# EAGLE design CS_NAV (EAGLE 9.4.2)
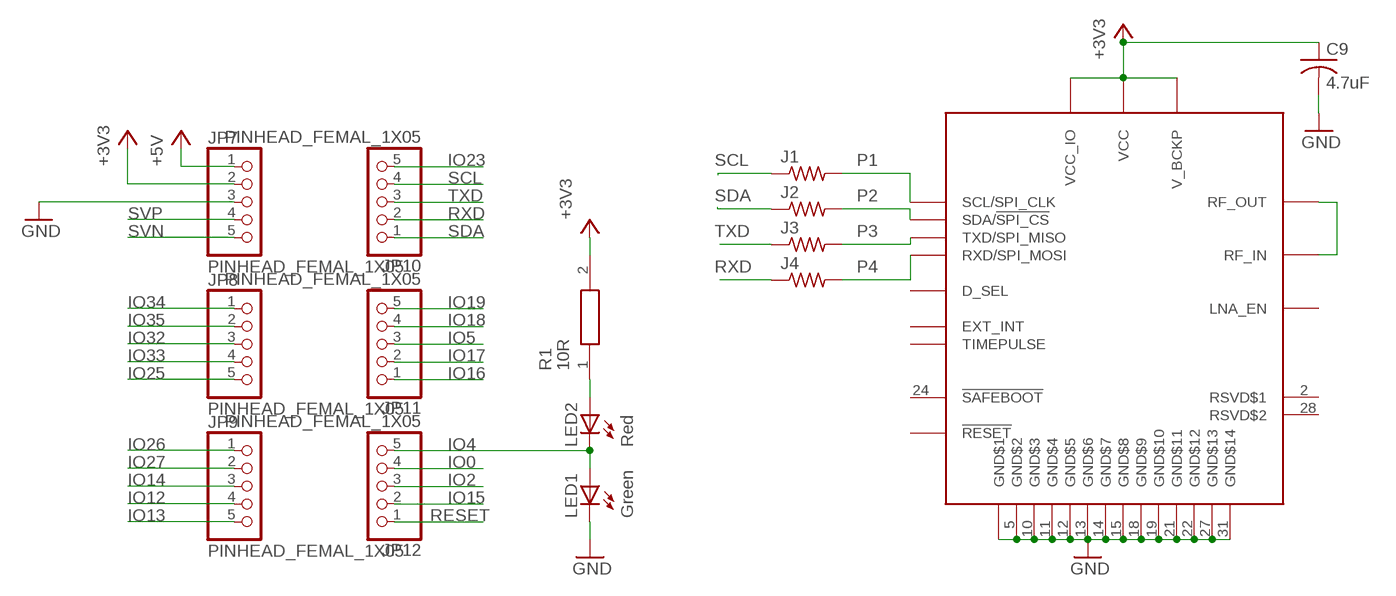
[diagram p0: schematic, sheet 1]

## Parts
C9  4.7uF  C-USC0805  [C0805]
CAM-M8C/Q  CAM-M8  [CAM-M8]
J1  R-US_R1206  [R1206]
J2  R-US_R1206  [R1206]
J3  R-US_R1206  [R1206]
J4  R-US_R1206  [R1206]
JP7  PINHEAD_FEMAL_1X05  [1X05F]
JP8  PINHEAD_FEMAL_1X05  [1X05F]
JP9  PINHEAD_FEMAL_1X05  [1X05F]
JP10  PINHEAD_FEMAL_1X05  [1X05F]
JP11  PINHEAD_FEMAL_1X05  [1X05F]
JP12  PINHEAD_FEMAL_1X05  [1X05F]
LED1  Green  LEDCHIPLED_0805  [CHIPLED_0805]
LED2  Red  LEDCHIPLED_0805  [CHIPLED_0805]
R1  10R  ERA-6AED684V  [RESC2012X60N]

## Nets
+3V3: C9.1 CAM-M8C/Q.1(VCC_IO) CAM-M8C/Q.8(V_BCKP) CAM-M8C/Q.9(VCC) JP7.2 R1.2
+5V: JP7.1
GND: C9.2 CAM-M8C/Q.4(GND$1) CAM-M8C/Q.5(GND$2) CAM-M8C/Q.10(GND$3) CAM-M8C/Q.11(GND$4) CAM-M8C/Q.12(GND$5) CAM-M8C/Q.13(GND$6) CAM-M8C/Q.14(GND$7) CAM-M8C/Q.15(GND$8) CAM-M8C/Q.18(GND$9) CAM-M8C/Q.19(GND$10) CAM-M8C/Q.21(GND$11) CAM-M8C/Q.22(GND$12) CAM-M8C/Q.27(GND$13) CAM-M8C/Q.31(GND$14) JP7.3 LED1.C
IO0: JP12.4
IO2: JP12.3
IO4: JP12.5 LED1.A LED2.C
IO5: JP11.3
IO12: JP9.4
IO13: JP9.5
IO14: JP9.3
IO15: JP12.2
IO16: JP11.1
IO17: JP11.2
IO18: JP11.4
IO19: JP11.5
IO23: JP10.5
IO25: JP8.5
IO26: JP9.1
IO27: JP9.2
IO32: JP8.3
IO33: JP8.4
IO34: JP8.1
IO35: JP8.2
N$1: CAM-M8C/Q.16(RF_OUT) CAM-M8C/Q.17(RF_IN)
N$2: LED2.A R1.1
P1: CAM-M8C/Q.6(SCL/SPI_CLK) J1.2
P2: CAM-M8C/Q.3(SDA/!SPI_CS) J2.2
P3: CAM-M8C/Q.25(TXD/SPI_MISO) J3.2
P4: CAM-M8C/Q.26(RXD/SPI_MOSI) J4.2
RESET: JP12.1
RXD: J4.1 JP10.2
SCL: J1.1 JP10.4
SDA: J2.1 JP10.1
SVN: JP7.5
SVP: JP7.4
TXD: J3.1 JP10.3
Unconnected: CAM-M8C/Q.2(RSVD$1) CAM-M8C/Q.7(EXT_INT) CAM-M8C/Q.20(D_SEL) CAM-M8C/Q.23(!RESET) CAM-M8C/Q.24(!SAFEBOOT) CAM-M8C/Q.28(RSVD$2) CAM-M8C/Q.29(TIMEPULSE) CAM-M8C/Q.30(LNA_EN)

## Library data of the parts
C9 = rcl:C-US: CAPACITOR, American symbol; SPICEPREFIX: C
CAM-M8C/Q = SamacSys_3D:CAM-M8: CAM-M8x: M8 Concurrent GNSS Antenna Module u-blox.com
J1-J4 = rcl:R-US_: RESISTOR, American symbol; SPICEPREFIX: R
JP7-JP12 = SamacSys_3D:PINHEAD_FEMAL_1X05
LED1 LED2 = adafruit:LED: LED OSRAM: - CHIPLED LG R971, LG N971, LY N971, LG Q971, LY Q971, LO R971, LY R971 LH N974, LH R974 LS Q976, LO Q976, LY Q976 LO Q996 - Hyper CHIPLED LW Q18S LB Q993, LB Q99A, LB R99A - SideLED LS A670, LO A670, LY A670, LG A670, LP A670 LB A673, LV A673, LT A673, LW A673 LH A674 LY A675 LS A676, LA A676, LO A676, LY A676, LW A676 LS A679, LY A679, LG A679 - Hyper Micro SIDELED® LS Y876, LA Y876, LO Y876, LY Y876 LT Y87S - SmartLED LW L88C, LW L88S LB L89C, LB L89S, LG L890 LS L89K, LO L89K, LY L89K LS L896, LA L896, LO L896, LY L896 - TOPLED LS T670, LO T670, LY T670, LG T670, LP T670 LSG T670, LSP T670, LSY T670, LOP T670, LYG T670 LG T671, LOG T671, LSG T671 LB T673, LV T673, LT T673, LW T673 LH T674 LS T676, LA T676, LO T676, LY T676, LB T676, LH T676, LSB T676, LW T676 LB T67C, LV T67C, LT T67C, LS T67K, LO T67K, LY T67K, LW E67C LS E67B, LA E67B, LO E67B, LY E67B, LB E67C, LV E67C, LT E67C LW T67C LS T679, LY T679, LG T679 LS T770, LO T770, LY T770, LG T770, LP T770 LB T773, LV T773, LT T773, LW T773 LH T774 LS E675, LA E675, LY E675, LS T675 LS T776, LA T776, LO T776, LY T776, LB T776 LHGB T686 LT T68C, LB T68C - Hyper Mini TOPLED® LB M676 - Mini TOPLED Santana® LG M470 LS M47K, LO M47K, LY M47K Source: http://www.osram.convergy.de/
R1 = SamacSys_Parts:ERA-6AED684V: Thin Film Resistors - SMD 0805 680Kohms 25ppm 0.5% AEC-Q200 Source: Datasheet <https://industrial.panasonic.com/cdbs/www-data/pdf/RDA0000/AOA0000C237.pdf>; DESCRIPTION: Thin Film Resistors - SMD 0805 680Kohms 25ppm 0.5% AEC-Q200; HEIGHT: 0.6mm; MANUFACTURER_NAME: Panasonic; MANUFACTURER_PART_NUMBER: ERA-6AED684V; MOUSER_PART_NUMBER: 667-ERA-6AED684V; MOUSER_PRICE-STOCK: https://www.mouser.com/Search/Refine.aspx?Keyword=667-ERA-6AED684V

## Board
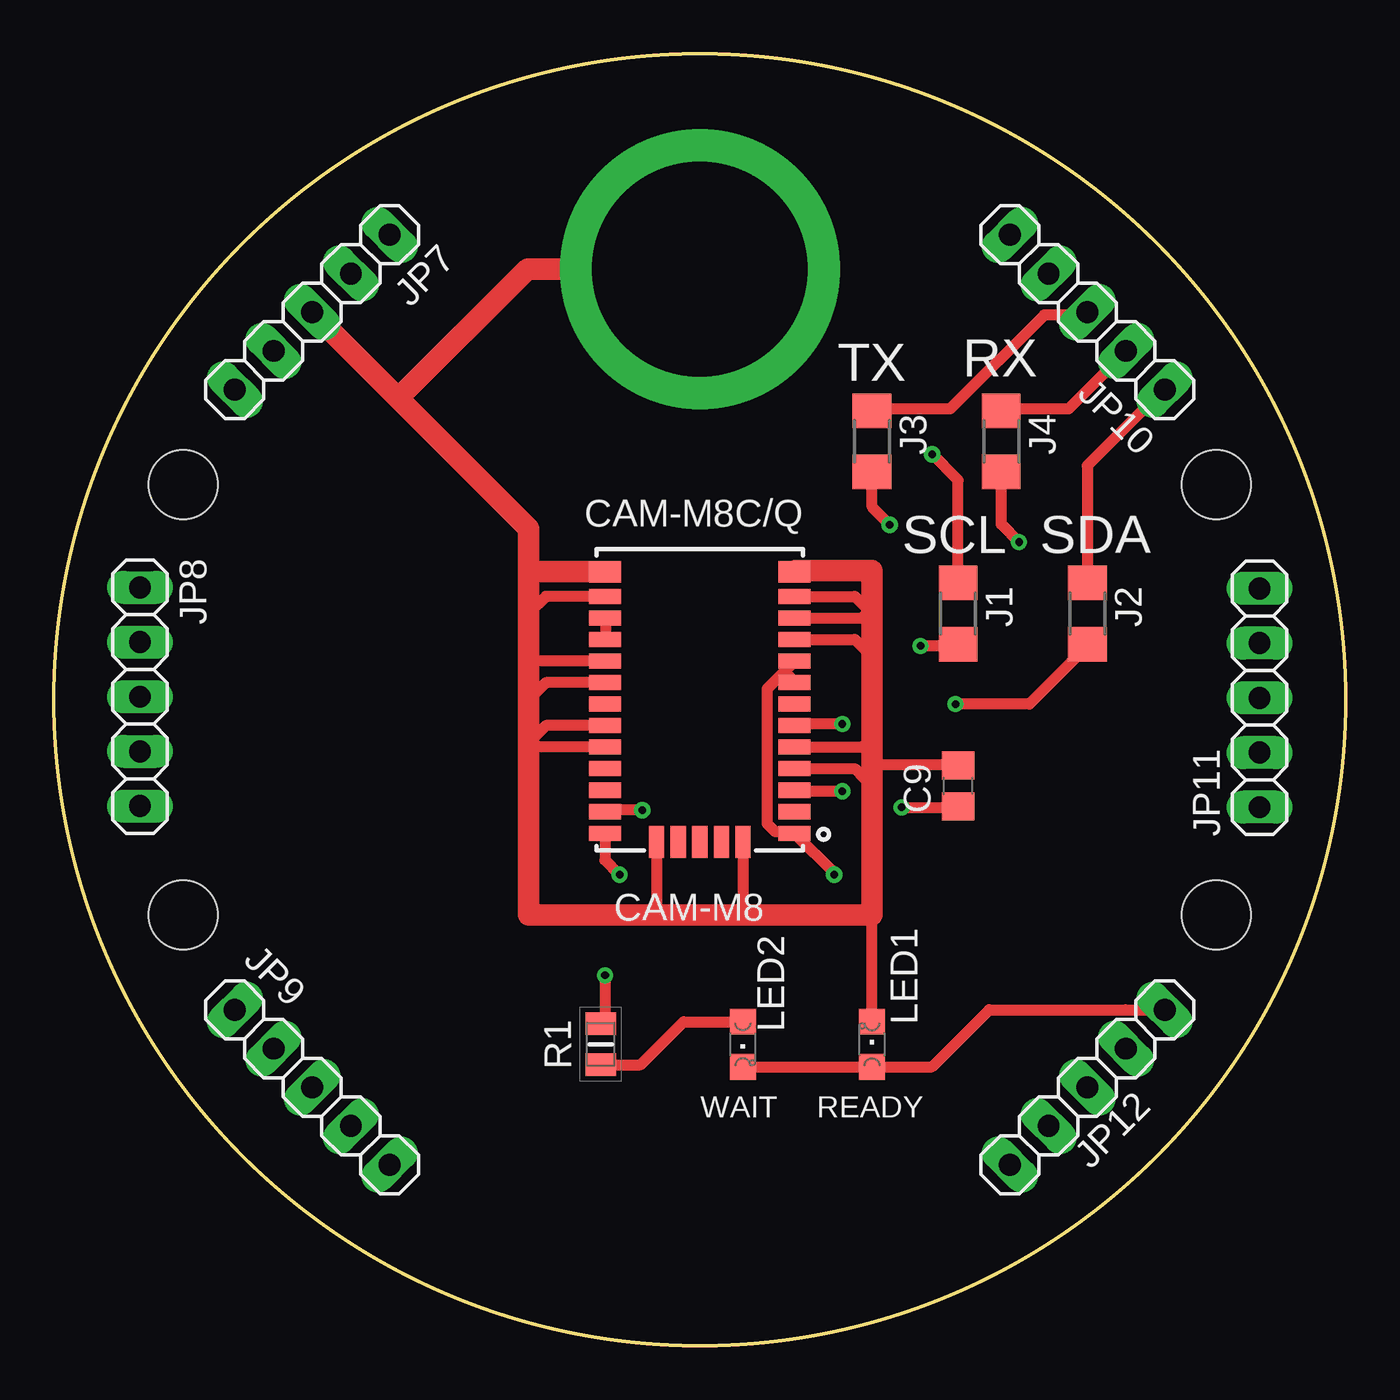
[diagram p1: board, top side]
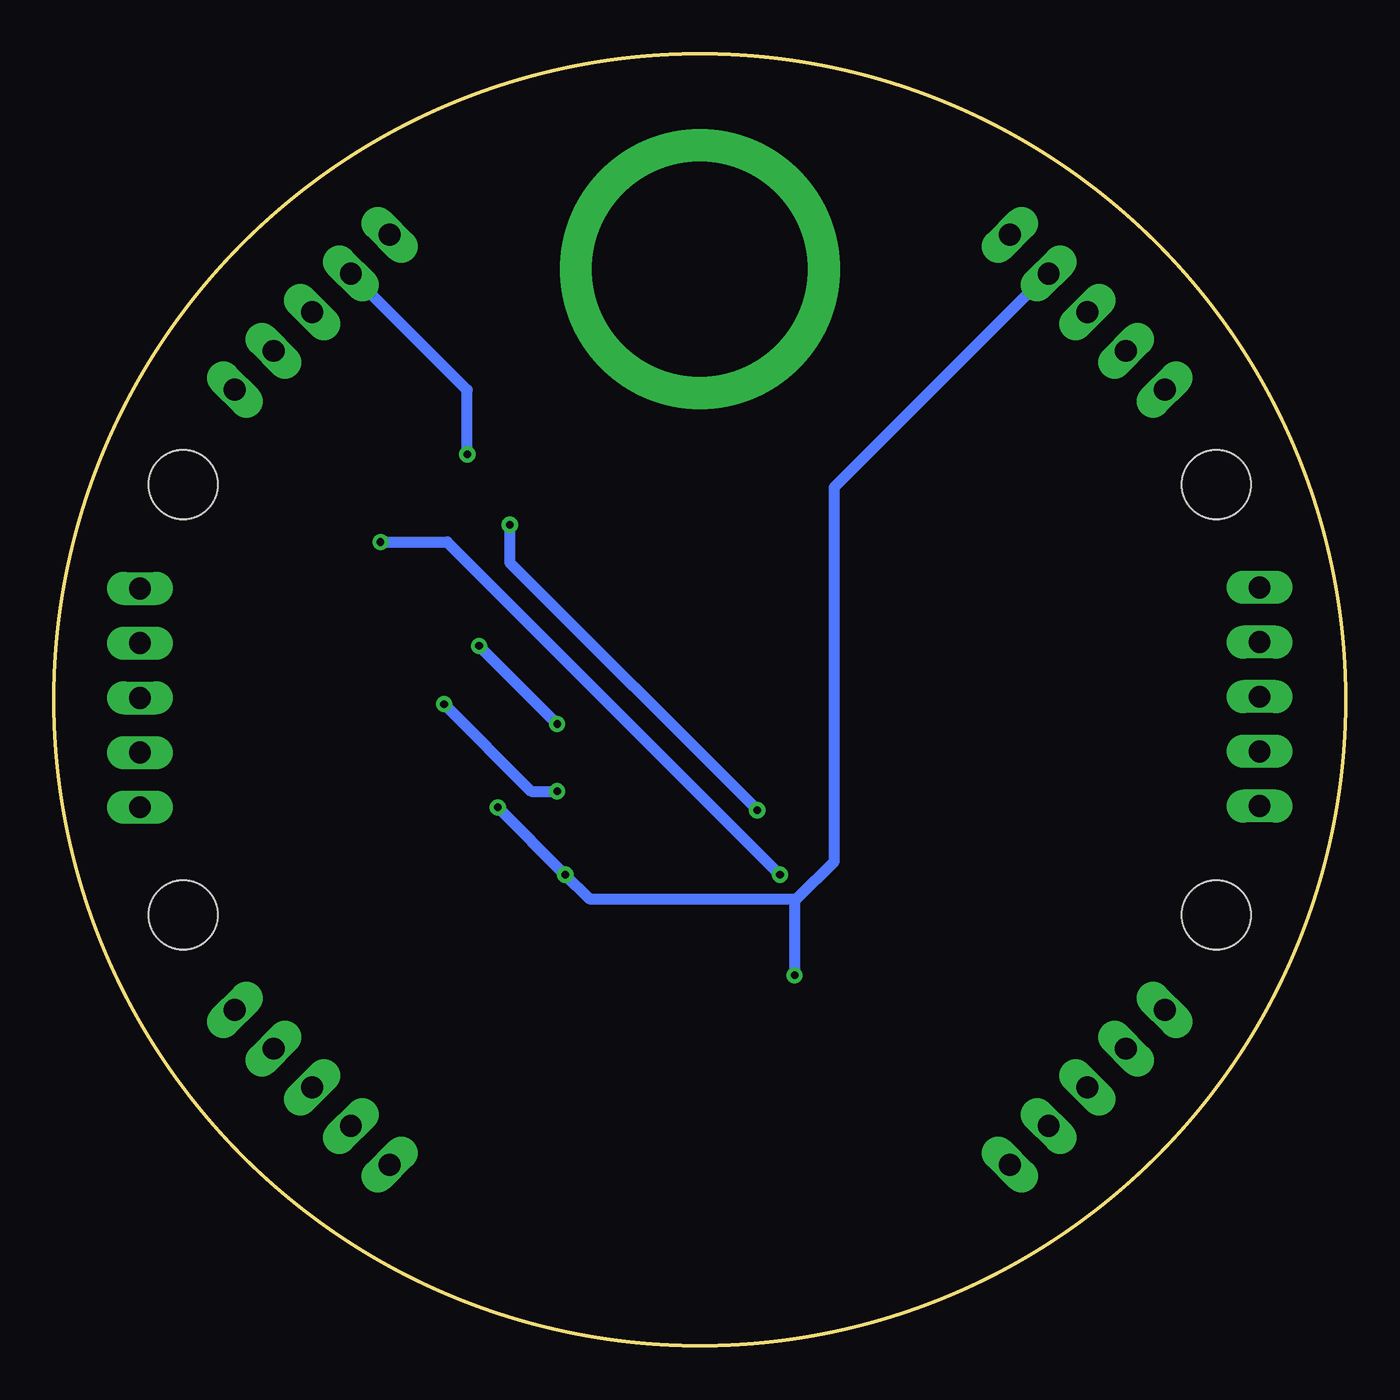
[diagram p2: board, bottom side, seen from below]

Size 60 x 60 mm. Coordinates in mm from the lower left corner, seen from the top.
Outline: circle at 30,30 radius 30
Copper layers (1*16): Top 0.035mm / dielectric 1.5mm / Bottom 0.035mm
Design rules "CanSat *": minimum track width 0.5mm, minimum drill 0.35mm, track to track 15mil, track to pad 10mil, pad to pad 8mil, via to via 15mil, smd to smd 6mil, copper to edge 1.5mm, drill to drill 10mil, minimum pad ring 10mil, minimum via ring 8mil, stop-mask expansion 6mil, vias tented up to drill 0mil, thermal gap 8mil
Holes 3.2 mm at 6,40 6,20 54,20 54,40

### Footprints (pad centres in the part's own frame; a part is rotated, then mirrored left to right if it is on the bottom)
C0805 = smd 1.3 x 1.5: 1 -0.95,0; 2 0.95,0
CAM-M8 = smd 0.7 x 1.5: 1 -6.2,-4.4; 2 -5.2,-4.4; 3 -4.2,-4.4; 4 -3.2,-4.4; 5 -2.2,-4.4; 6 -1.2,-4.4; 7 -0.2,-4.4; 8 0.8,-4.4; 9 1.8,-4.4; 10 2.8,-4.4; 11 3.8,-4.4; 12 4.8,-4.4; 15 4.8,4.4; 16 3.8,4.4; 17 2.8,4.4; 18 1.8,4.4; 19 0.8,4.4; 20 -0.2,4.4; 21 -1.2,4.4; 22 -2.2,4.4; 23 -3.2,4.4; 24 -4.2,4.4; 25 -5.2,4.4; 26 -6.2,4.4 | smd 1 x 1.5: 13 5.95,-4.4; 14 5.95,4.4 | smd 1.5 x 0.7: 27 -6.6,2; 28 -6.6,1; 29 -6.6,0; 30 -6.6,-1; 31 -6.6,-2
R1206 = smd 1.6 x 1.803: 1 -1.422,0; 2 1.422,0
1X05F = drill 1.016 long: 1 -5.08,0; 2 -2.54,0; 3 0,0; 4 2.54,0; 5 5.08,0
CHIPLED_0805 = smd 1.2 x 1.2: A 0,-1.05; C 0,1.05
RESC2012X60N = smd 1.05 x 1.4: 1 -0.95,0; 2 0.95,0

### Placement (x,y rotation side)
C9  42,26 90 top
CAM-M8C/Q  30,30 90 top
J1  42,34 270 top
J2  48,34 270 top
J3  38,42 270 top
J4  44,42 270 top
JP7  12,48 225 top
JP8  4,30.14 270 top
JP9  12,12 315 top
JP10  48,48 135 top
JP11  56,30.09 90 top
JP12  48,12 45 top
LED1  38,14 0 top
LED2  32,14 180 top
R1  25.4,14 90 top

### Tracks (layer width: path | path; a pad name or v marks a point on that pad's centre or on a via)
+3V3  (via drill 0.35)
  Top 0.5: 33.94,31.31 34.38,31.75 CAM-M8C/Q.9 | 33.94,31.31 33.12,30.5 33.12,24.25 33.5,23.88 34.38,23.88 CAM-M8C/Q.1 36.25,21.95 v36.25,21.88 | 33.94,31.31 34.38,30.88 CAM-M8C/Q.8 | v39.38,25 42,25 C9.1 | v25.6,17.2 25.6,15.15 R1.2
  Bottom 0.5: v39.38,25 v36.25,21.88 35.12,20.75 25.5,20.75 | 25.5,20.75 23.75,22.5 23.75,39.88 13.88,49.75 JP7.2 | 25.5,20.75 25.6,20.65 v25.6,17.2
GND  (via drill 10 pad 13)
  Top 0.5: CAM-M8C/Q.15 22.85,34.8 22.05,34 | CAM-M8C/Q.18 22.25,31.8 22.05,32 | CAM-M8C/Q.19 22.85,30.8 22.05,30 | CAM-M8C/Q.21 22.85,28.8 22.05,28 22.12,28 22.25,27.8 CAM-M8C/Q.22 | CAM-M8C/Q.4 37.2,26.8 37.62,26.38 | 37.62,26.38 38,26 | CAM-M8C/Q.5 37.62,27.8 | 37.62,27.8 37.8,27.8 | CAM-M8C/Q.10 37.2,32.8 38,32 | CAM-M8C/Q.11 37.62,33.8 | 37.62,33.8 37.8,33.8 | CAM-M8C/Q.12 37.2,34.8 38,34 37.62,33.88 37.62,33.8 | CAM-M8C/Q.27 28,20 | CAM-M8C/Q.31 32,20 | 25.62,35.88 CAM-M8C/Q.14 | C9.2 42,27 38,27 37.75,26.62 37.75,26.5 37.62,26.38 | 34.5,36 CAM-M8C/Q.13 | 37.62,27.8 37.62,27.88 38,28 | LED1.C 38,20
  Top 1: 22.05,35.95 22.05,34 22.05,32 22.05,30 22.05,28 22.05,20 28,20 32,20 38,20 38,26 38,27 38,28 38,32 38,34 38,36 34.5,36 34.45,36 | JP7.3 16,44 | 16,44 22.05,37.95 22.05,35.95 | 16,44 22,50 v30,50 | CAM-M8C/Q.14 22.05,35.95
IO4
  Top 0.5: LED2.C LED1.A 40.8,12.95 43.45,15.6 49.78,15.6 49.79,15.59 JP12.5
N$1
  Top 0.5: CAM-M8C/Q.17 25.62,32.88 25.62,33.75 CAM-M8C/Q.16
N$2
  Top 0.5: R1.1 27.25,13.05 29.25,15.05 LED2.A
P1  (via drill 0.35)
  Top 0.5: v36.62,28.88 34.5,28.88 CAM-M8C/Q.6 | v40.25,32.5 42,32.5 J1.2
  Bottom 0.5: v40.25,32.5 v36.62,28.88
P2  (via drill 0.35)
  Top 0.5: v36.62,25.75 34.5,25.75 CAM-M8C/Q.3 | v41.88,29.8 45.3,29.8 48,32.5 J2.2
  Bottom 0.5: v41.88,29.8 37.83,25.75 v36.62,25.75
P3  (via drill 0.35)
  Top 0.5: v27.32,24.88 25.62,24.88 CAM-M8C/Q.25 | v38.83,38.12 38,38.95 J3.2
  Bottom 0.5: v27.32,24.88 38.83,36.38 v38.83,38.12
P4  (via drill 0.35)
  Top 0.5: CAM-M8C/Q.26 25.6,22.55 v26.27,21.88 | v44.83,37.33 44,38.15 J4.2
  Bottom 0.5: v26.27,21.88 41.73,37.33 v44.83,37.33
RXD
  Top 0.5: J4.1 44,43.5 47.12,43.5 49.75,46.12 JP10.2
SCL  (via drill 0.35)
  Top 0.5: 46.12,49.75 JP10.4 | v40.8,41.4 42,40.2 J1.1
  Bottom 0.5: v40.8,41.4 40.8,44.39 JP10.4
SDA
  Top 0.5: J2.1 48,40.88 51.5,44.38 JP10.1
TXD
  Top 0.5: JP10.3 47.88,47.88 46,47.88 41.62,43.5 38,43.5 J3.1

### Text on the board
tNames: TX | RX | SCL | SDA | WAIT | READY